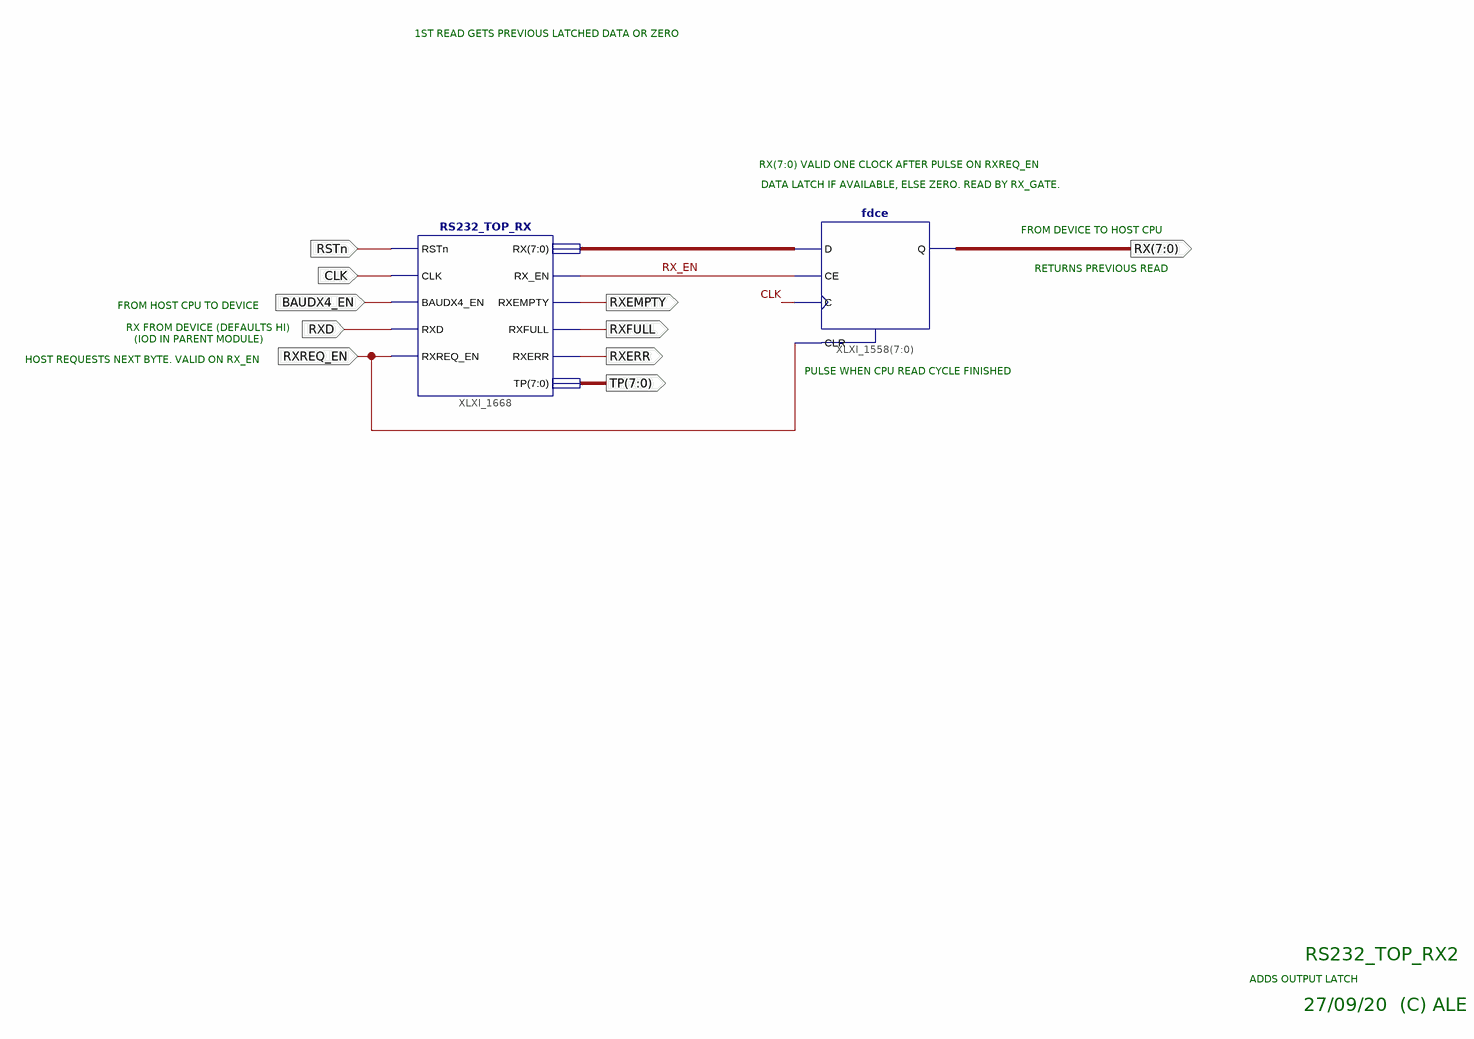
[diagram p0: schematic sheet 1]
// Xilinx ISE schematic RS232_TOP_RX2.sch (spartan3e) as structural Verilog: 2 symbols, 10 ports
module RS232_TOP_RX2 (
  input  RSTn,
  input  CLK,
  input  BAUDX4_EN,
  input  RXD,
  input  RXREQ_EN,
  output [7:0] RX,
  output RXEMPTY,
  output RXFULL,
  output RXERR,
  output [7:0] TP
);

  wire RX_EN;
  wire [7:0] XLXN_24;

  RS232_TOP_RX XLXI_1668 (
    .BAUDX4_EN(BAUDX4_EN), .CLK(CLK), .RSTn(RSTn), .RX(XLXN_24), .RXD(RXD), .RXEMPTY(RXEMPTY), .RXERR(RXERR),
    .RXFULL(RXFULL), .RXREQ_EN(RXREQ_EN), .RX_EN(RX_EN), .TP(TP));
  fdce XLXI_1558[7:0] (.C(CLK), .CE(RX_EN), .CLR(RXREQ_EN), .D(XLXN_24), .Q(RX));

  // Notes on the sheet:
  //   1ST READ GETS PREVIOUS LATCHED DATA OR ZERO
  //   RX(7:0) VALID ONE CLOCK AFTER PULSE ON RXREQ_EN
  //   DATA LATCH IF AVAILABLE, ELSE ZERO. READ BY RX_GATE.
  //   FROM DEVICE TO HOST CPU
  //   RETURNS PREVIOUS READ
  //   FROM HOST CPU TO DEVICE
  //   RX FROM DEVICE (DEFAULTS HI)
  //   (IOD IN PARENT MODULE)
  //   HOST REQUESTS NEXT BYTE. VALID ON RX_EN
  //   PULSE WHEN CPU READ CYCLE FINISHED
  //   RS232_TOP_RX2
  //   ADDS OUTPUT LATCH
  //   27/09/20  (C) ALE
endmodule
